# EasyEDA schematic barrel-encoder.json

## Sheets
1 Serial-To-Parallel Converter: TITLE: 8 Bit Serial to Parallel Converter; REV: 1.0; Date: 2020-07-02; Sheet: 1/1; Company: LEAP Org.
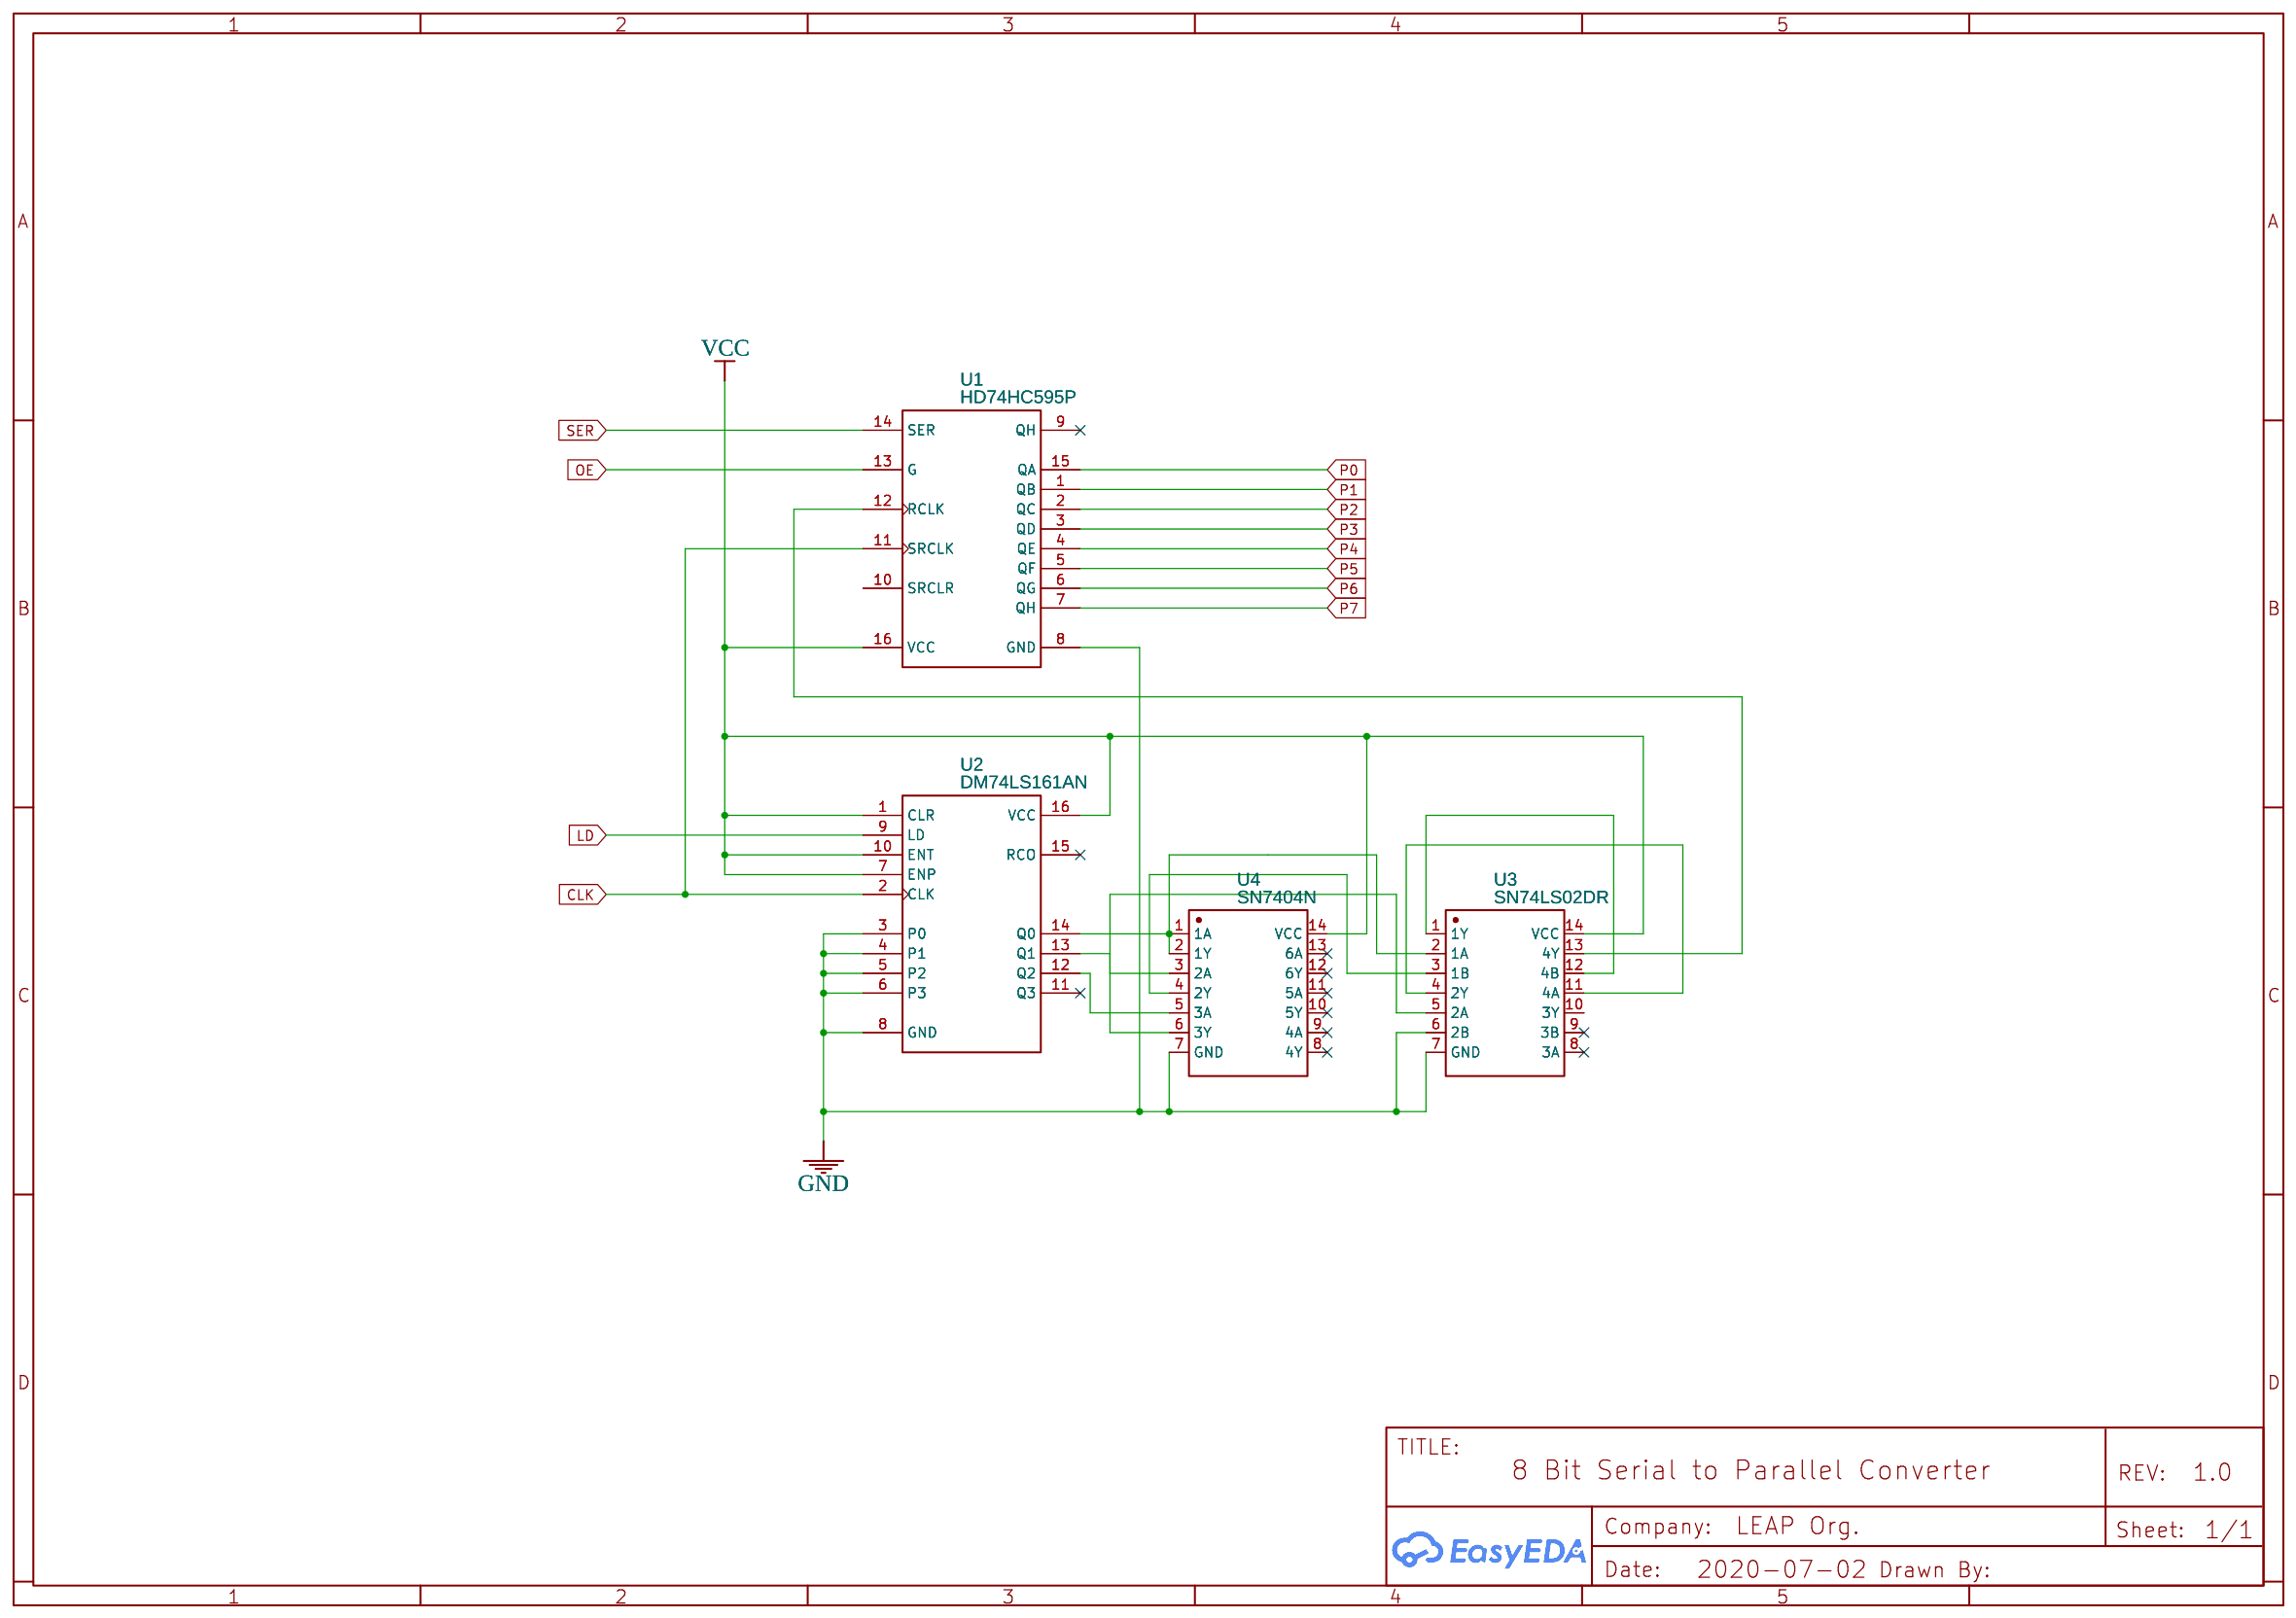
[diagram p0: Serial-To-Parallel Converter]
2 Pilot 8-bit Transmitter: TITLE: Pilot 8-bit Transmitter; Date: 2020-07-26; Drawn By: cSDes1gn; Company: LEAP Org
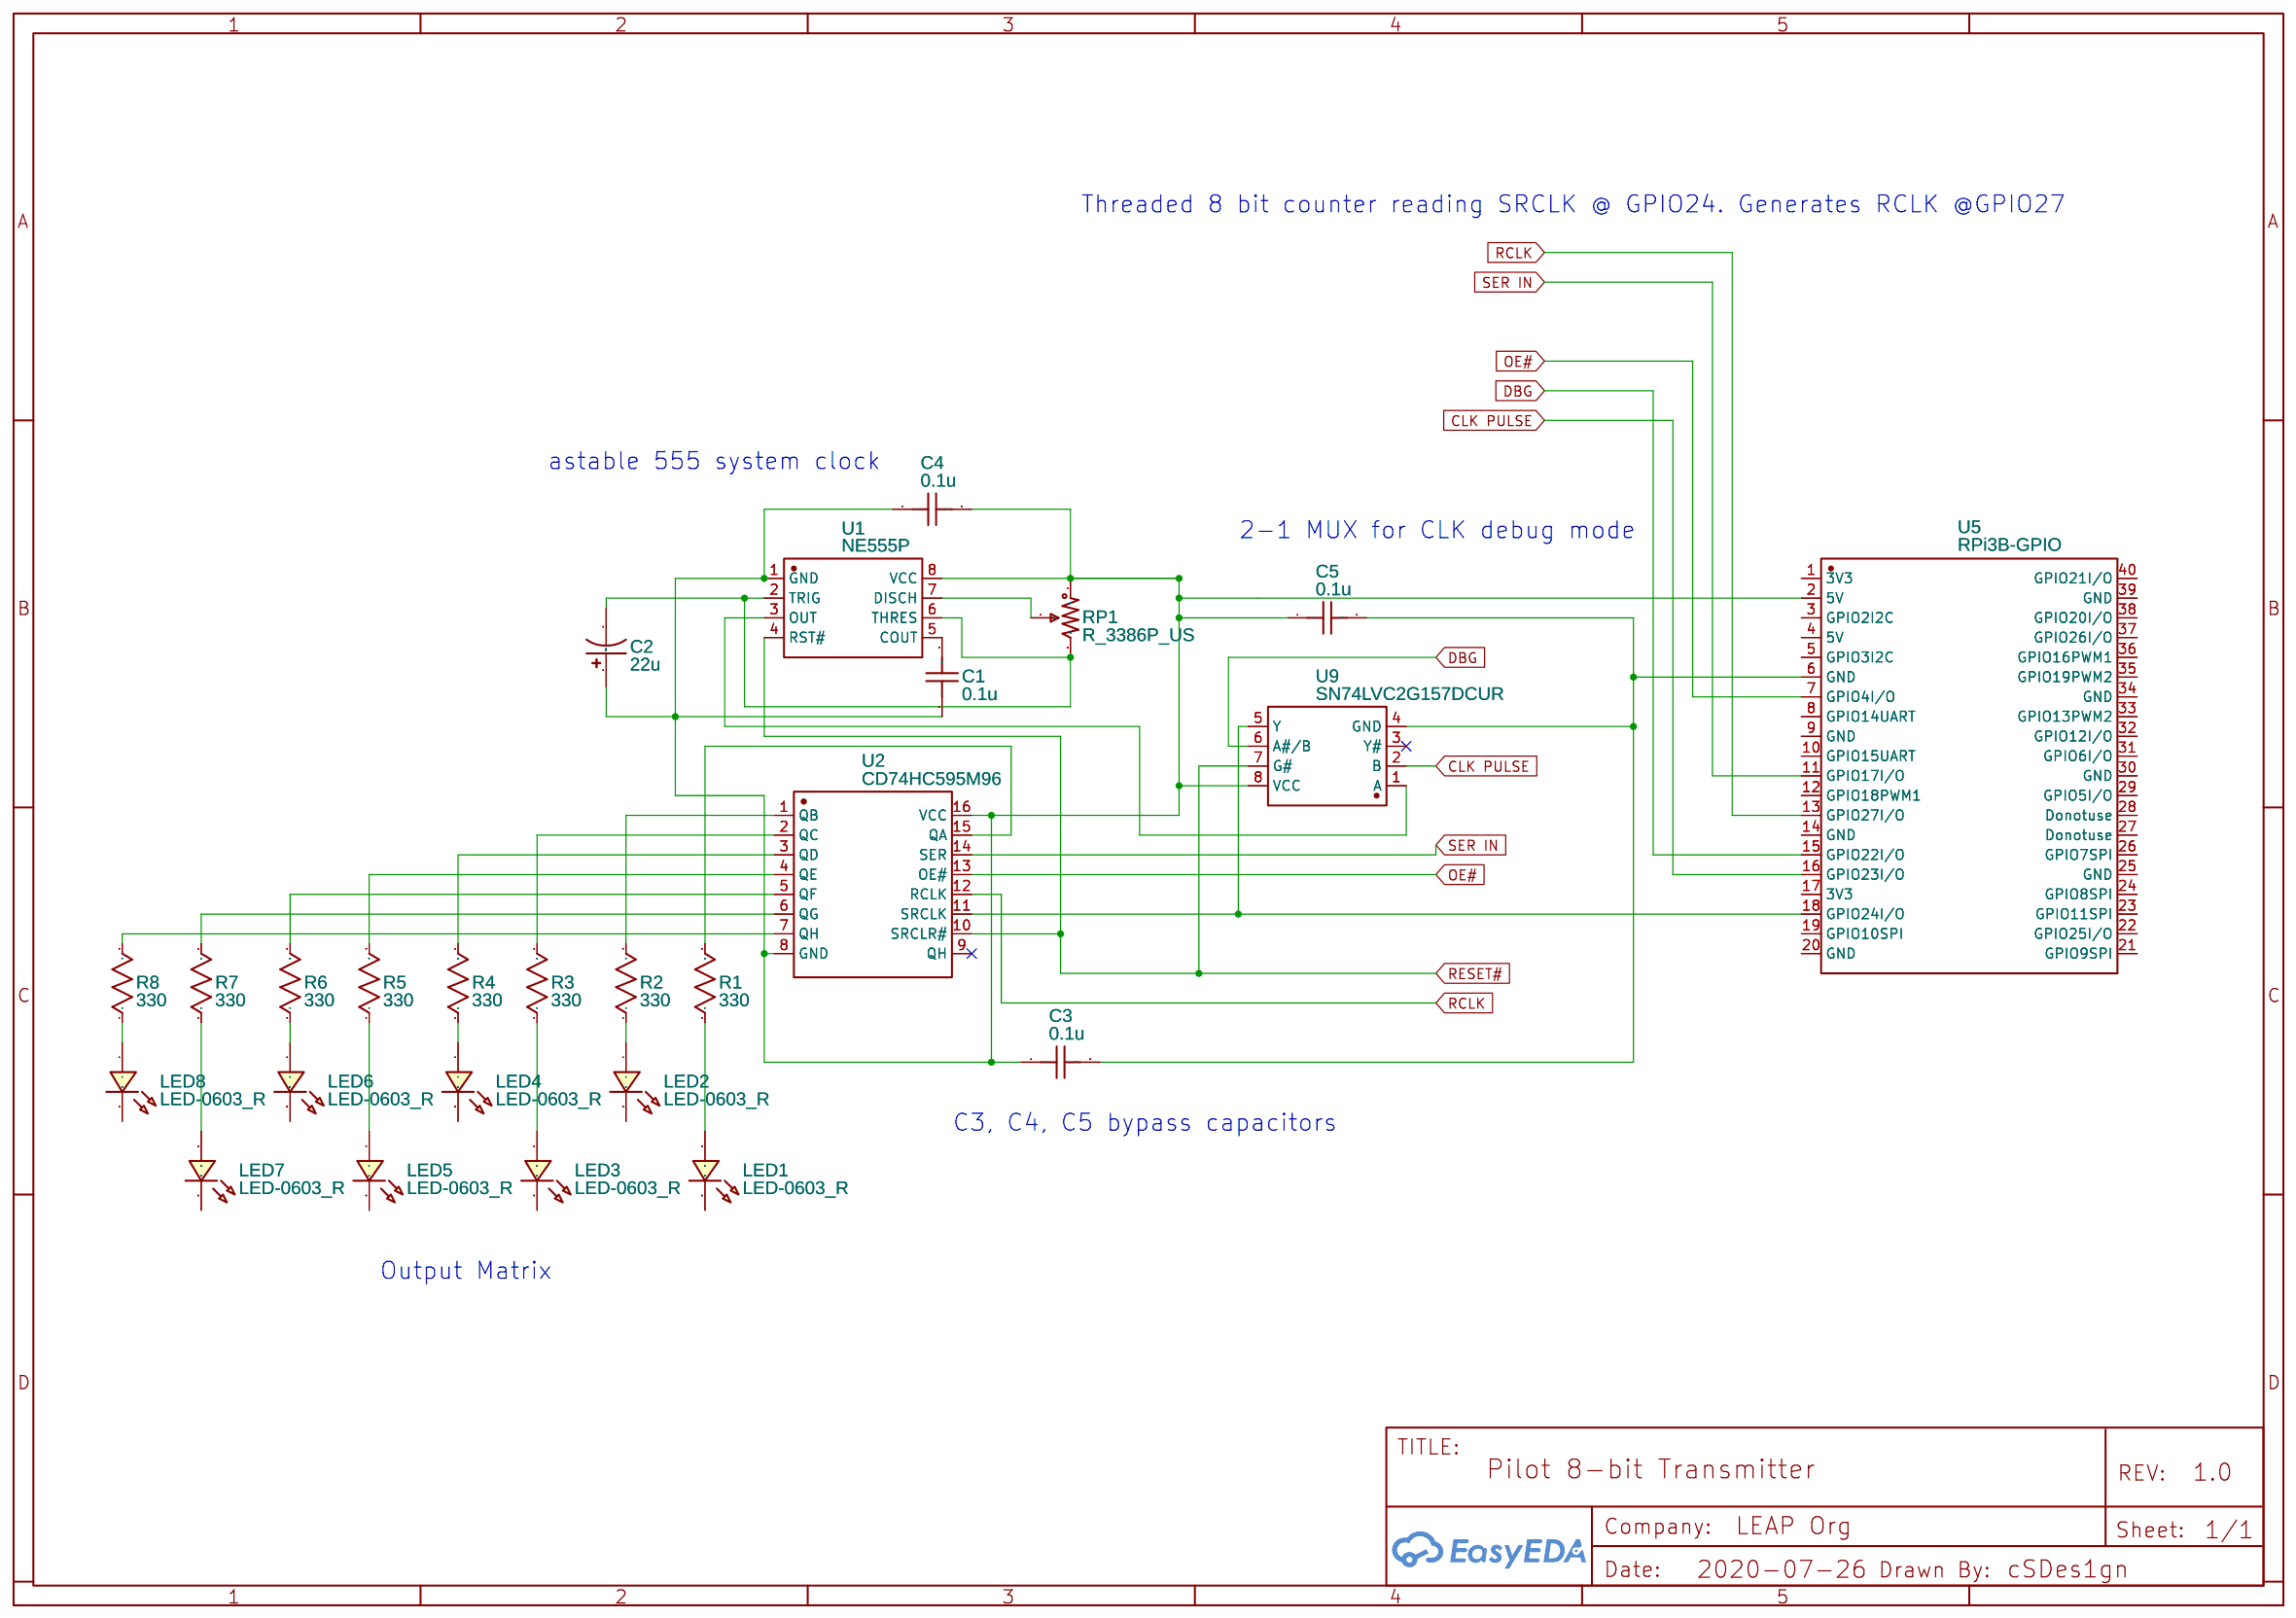
[diagram p1: Pilot 8-bit Transmitter]
3 Barrel Encoder: TITLE: Barrel Shifter; Date: 2020-10-22; Company: LEAP Systems
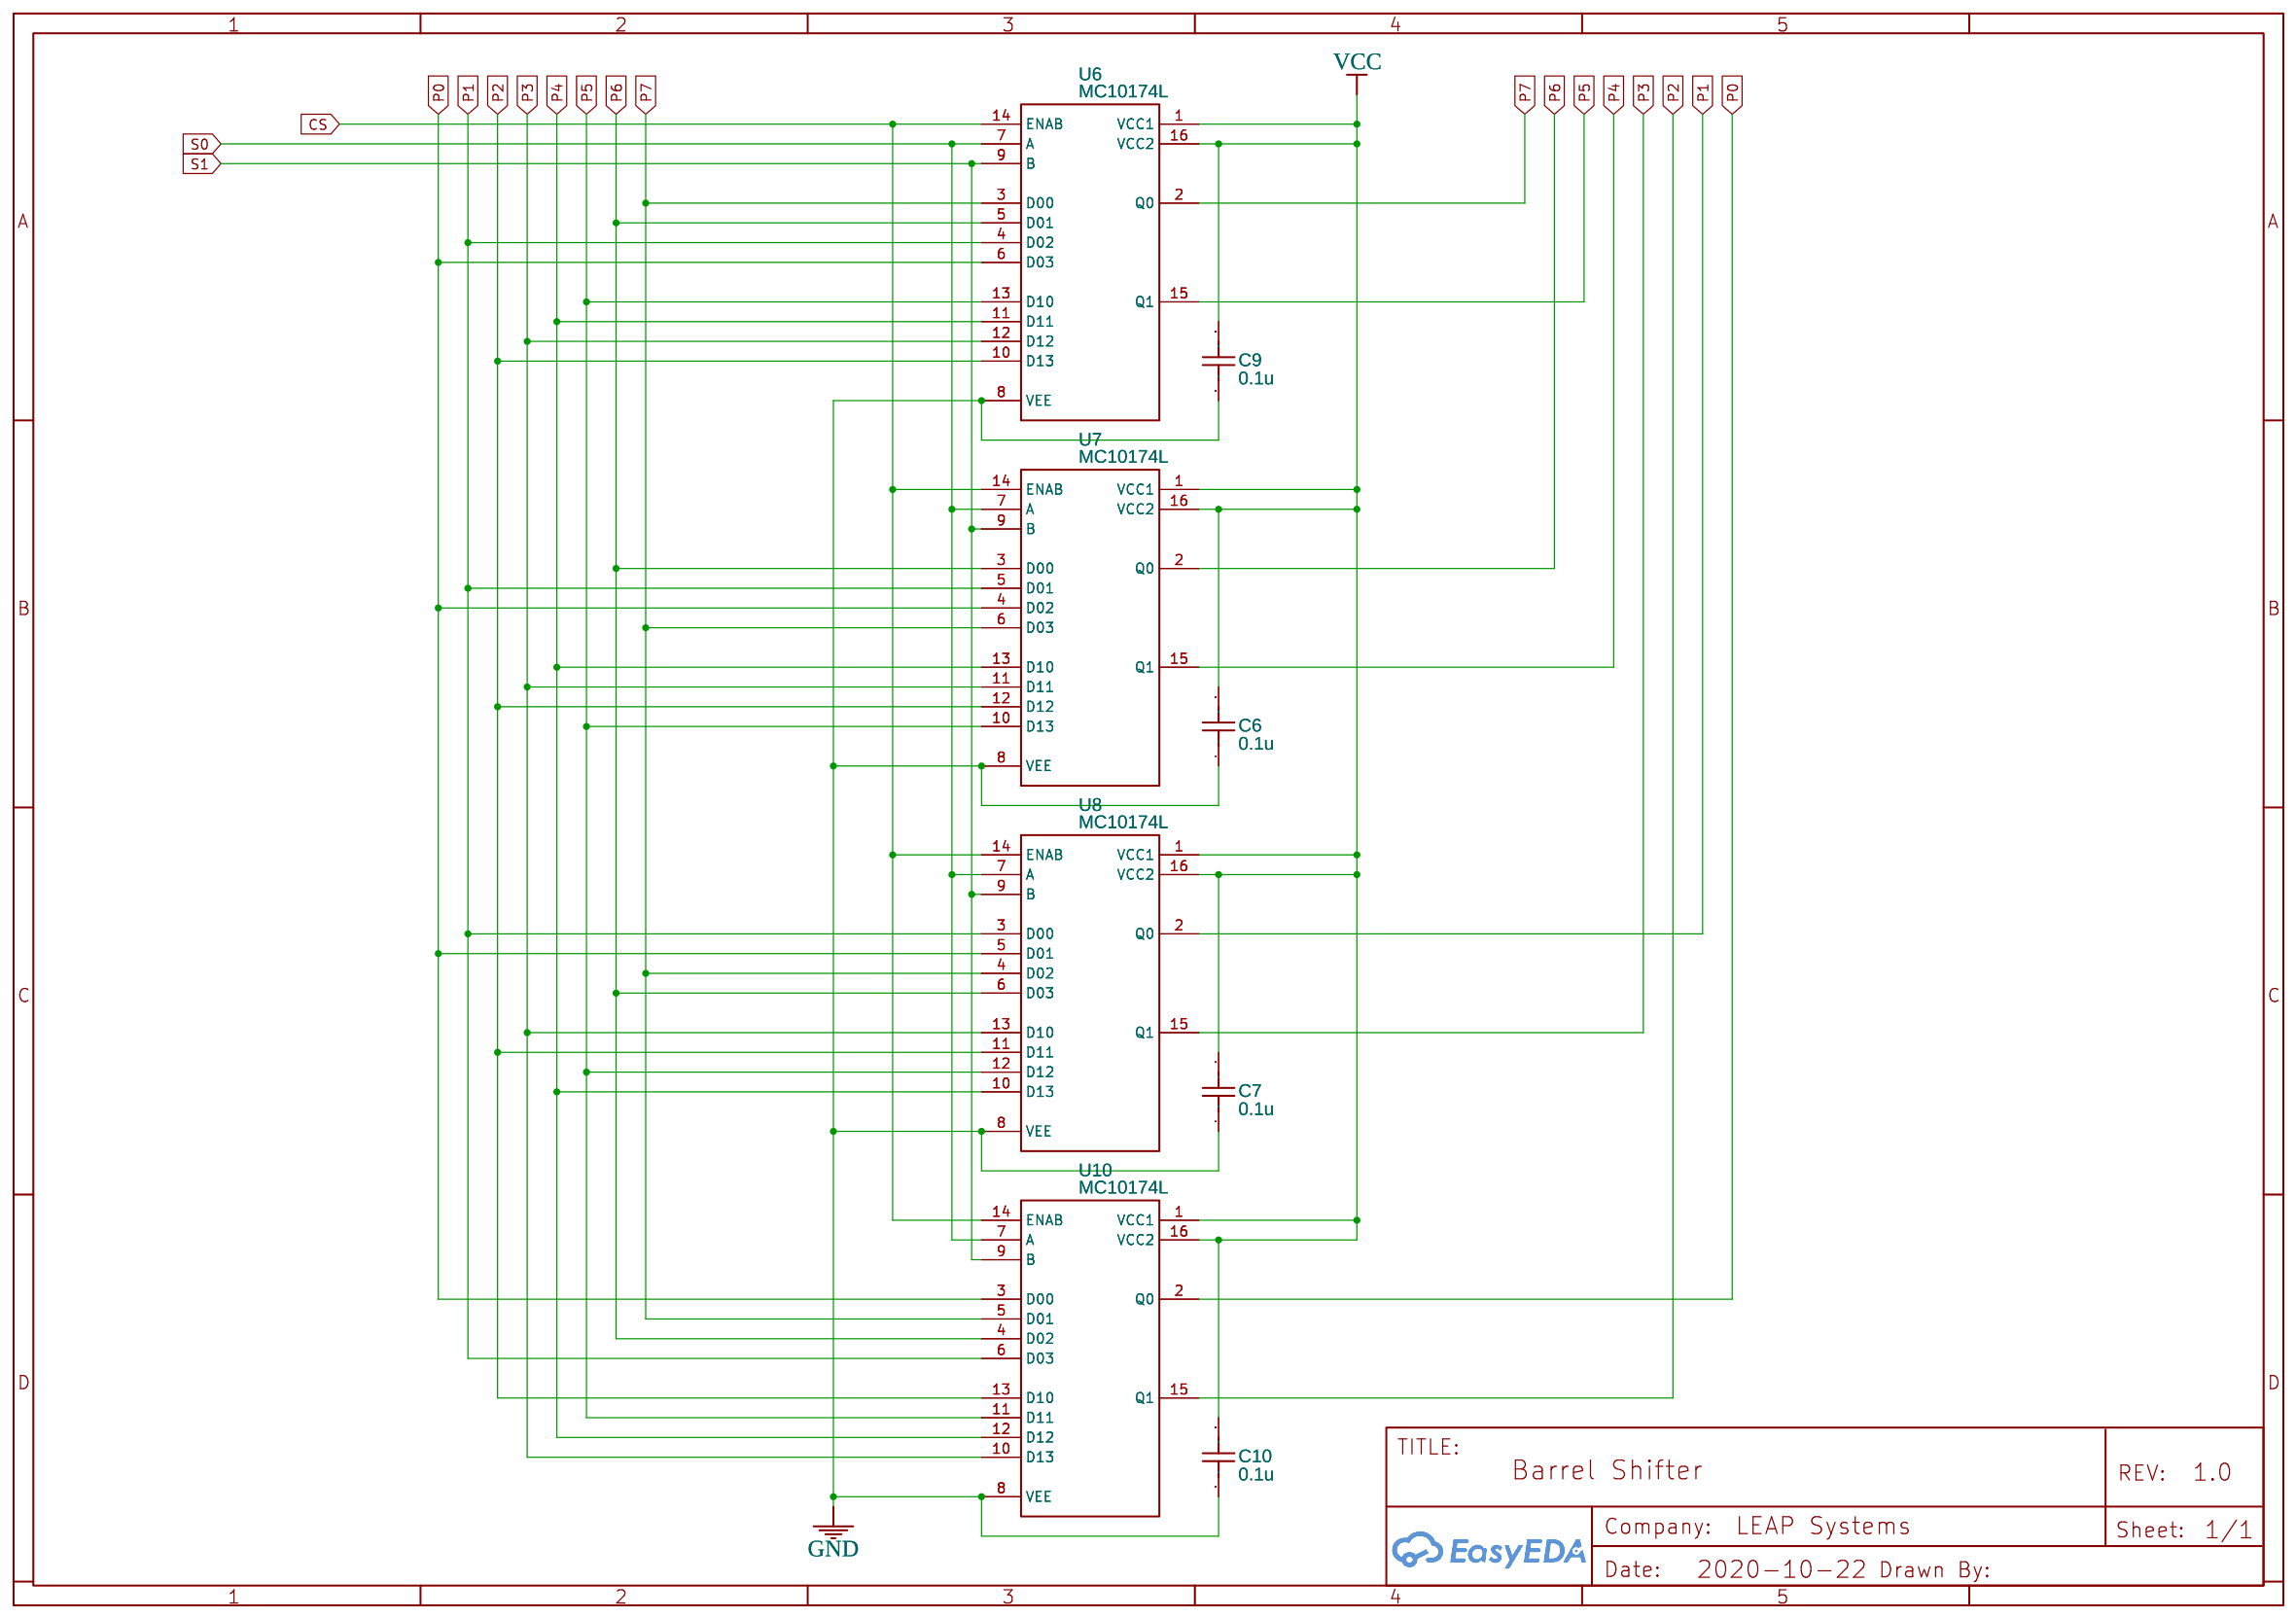
[diagram p2: Barrel Encoder]

## Parts
sheet Barrel Encoder
C6  0.1u  [C0603]
C7  0.1u  [C0603]
C9  0.1u  [C0603]
C10  0.1u  [C0603]
U6  MC10174L  [620-10]
U7  MC10174L  [620-10]
U8  MC10174L  [620-10]
U10  MC10174L  [620-10]
sheet Pilot 8-bit Transmitter
C1  0.1u  [C0201]
C2  22u  [CASE-A_3216]
C3  0.1u  [C0201]
C4  0.1u  [C0201]
C5  0.1u  [C0201]
LED1  LED-0603_R  [LED0603_RED]
LED2  LED-0603_R  [LED0603_RED]
LED3  LED-0603_R  [LED0603_RED]
LED4  LED-0603_R  [LED0603_RED]
LED5  LED-0603_R  [LED0603_RED]
LED6  LED-0603_R  [LED0603_RED]
LED7  LED-0603_R  [LED0603_RED]
LED8  LED-0603_R  [LED0603_RED]
R1  330  [R0201]
R2  330  [R0201]
R3  330  [R0201]
R4  330  [R0201]
R5  330  [R0201]
R6  330  [R0201]
R7  330  [R0201]
R8  330  [R0201]
RP1  R_3386P_US  [RES-ADJ-TH_3386P]
U1#2  NE555P  [DIP-8_L9.8-W6.6-P2.54-LS7.6-BL]
U2#2  CD74HC595M96  [SOIC-16_L10.8-W4.5-P1.27-LS6.8-BL]
U5  RPi3B-GPIO
U9  SN74LVC2G157DCUR  [VSSOP-8_L2.4-W2.1-P0.50-LS3.2-BL]
sheet Serial-To-Parallel Converter
U1  HD74HC595P  [DIP16]
U2  DM74LS161AN  [DIP16]
U3  SN74LS02DR  [SOIC-14_L8.7-W3.9-P1.27-LS6.0-BL]
U4  SN7404N  [DIP14]

## Library data of the parts
C6 C7 C9 C10 = C_0603_US: Contributor: LCEDA_Lib
U6-U8 U10 = MC10174L: Dual 4:1 Multiplexer
C1 C3-C5 = C_0201_US: Contributor: LCEDA_Lib
C2 = C_Tan_SMD_A_US: Contributor: LCEDA_Lib
LED1-LED8 = LED-0603_R: Manufacturer: EVERLIGHT(台湾亿光); Manufacturer Part: 19-217/R6C-AL1M2VY/3T; Supplier Part: C72044; Supplier: LCSC; Contributor: LCEDA_01
R1-R8 = R_0201_US: Contributor: LCEDA_Lib
RP1 = R_3386P_US: Supplier: LCSC; Contributor: LCEDA_Lib; value(Ω): 10K
U1#2 = NE555P: Supplier: LCSC; Manufacturer: TI; image: //image.lceda.cn/szlcsc/C46749.jpg; Supplier Part: C46749
U2#2 = CD74HC595M96: Supplier: LCSC; Manufacturer: TI; Supplier Part: C131977; LCSC Assembly: Yes; SMT Type: Extend
U5 = RPi3B-GPIO: Contributor: gamehero00s
U9 = SN74LVC2G157DCUR: Supplier: LCSC; Supplier Part: C473347; Manufacturer: Texas Instruments; Contributor: LCSC
U1 = HD74HC595P: 8-bit Shift Register  Latch with 3-State Outputs
U2 = DM74LS161AN: Synchronous 4-Bit Binary Counter
U3 = SN74LS02DR: Supplier: LCSC; Manufacturer: TI; image: //image.lceda.cn/szlcsc/C6794.jpg; Supplier Part: C6794; LCSC Assembly: Yes; SMT Type: Extend
U4 = SN7404N

## Nets
GND: C6.1 C7.1 C9.1 C10.1 U1.8(GND) U2.3(P0) U2.4(P1) U2.5(P2) U2.6(P3) U2.8(GND) U3.6(2B) U3.7(GND) U4.7(GND) U6.8(VEE) U7.8(VEE) U8.8(VEE) U10.8(VEE)
VCC: C6.2 C7.2 C9.2 C10.2 U1.16(VCC) U2.1(CLR) U2.7(ENP) U2.10(ENT) U2.16(VCC) U3.14(VCC) U4.14(VCC) U6.1(VCC1) U6.16(VCC2) U7.1(VCC1) U7.16(VCC2) U8.1(VCC1) U8.16(VCC2) U10.1(VCC1) U10.16(VCC2)
CLK: U1.11(SRCLK) U2.2(CLK)
CLK PULSE: U5.16(GPIO23I/O) U9.2(B)
CS: U6.14(ENAB) U7.14(ENAB) U8.14(ENAB) U10.14(ENAB)
DBG: U5.15(GPIO22I/O) U9.6(A#/B)
LD: U2.9(LD)
OE: U1.13(G)
OE#: U2#2.13(OE#) U5.7(GPIO4I/O)
P0: U1.15(QA) U6.6(D03) U7.4(D02) U8.5(D01) U10.2(Q0) U10.3(D00)
P1: U1.1(QB) U6.4(D02) U7.5(D01) U8.2(Q0) U8.3(D00) U10.6(D03)
P2: U1.2(QC) U6.10(D13) U7.12(D12) U8.11(D11) U10.13(D10) U10.15(Q1)
P3: U1.3(QD) U6.12(D12) U7.11(D11) U8.13(D10) U8.15(Q1) U10.10(D13)
P4: U1.4(QE) U6.11(D11) U7.13(D10) U7.15(Q1) U8.10(D13) U10.12(D12)
P5: U1.5(QF) U6.13(D10) U6.15(Q1) U7.10(D13) U8.12(D12) U10.11(D11)
P6: U1.6(QG) U6.5(D01) U7.2(Q0) U7.3(D00) U8.6(D03) U10.4(D02)
P7: U1.7(QH) U6.2(Q0) U6.3(D00) U7.6(D03) U8.4(D02) U10.5(D01)
RCLK: U2#2.12(RCLK) U5.13(GPIO27I/O)
RESET#: U1#2.4(RST#) U2#2.10(SRCLR#) U9.7(G#)
S0: U6.7(A) U7.7(A) U8.7(A) U10.7(A)
S1: U6.9(B) U7.9(B) U8.9(B) U10.9(B)
SER: U1.14(SER)
SER IN: U2#2.14(SER) U5.11(GPIO17I/O)
Net-(C1-1): C1.1 C2.1 C3.1 C4.1 C4.2 C5.1 RP1.1 U1#2.1(GND) U1#2.8(VCC) U2#2.8(GND) U2#2.16(VCC) U5.2(5V) U9.8(VCC)
Net-(C1-2): C1.2 U1#2.5(COUT)
Net-(C2-2): C2.2 RP1.3 U1#2.2(TRIG) U1#2.6(THRES)
Net-(C3-2): C3.2 C5.2 U5.6(GND) U9.4(GND)
Net-(LED1-1): LED1.1 R1.1
Net-(LED2-1): LED2.1 R2.1
Net-(LED3-1): LED3.1 R3.1
Net-(LED4-1): LED4.1 R4.1
Net-(LED5-1): LED5.1 R5.1
Net-(LED6-1): LED6.1 R6.1
Net-(LED7-1): LED7.1 R7.1
Net-(LED8-1): LED8.1 R8.1
Net-(R1-2): R1.2 U2#2.15(QA)
Net-(R2-2): R2.2 U2#2.1(QB)
Net-(R3-2): R3.2 U2#2.2(QC)
Net-(R4-2): R4.2 U2#2.3(QD)
Net-(R5-2): R5.2 U2#2.4(QE)
Net-(R6-2): R6.2 U2#2.5(QF)
Net-(R7-2): R7.2 U2#2.6(QG)
Net-(R8-2): R8.2 U2#2.7(QH)
Net-(RP1-2): RP1.2 U1#2.7(DISCH)
Net-(U1#2-3): U1#2.3(OUT) U9.1(A)
Net-(U1-12): U1.12(RCLK) U3.13(4Y)
Net-(U2#2-11): U2#2.11(SRCLK) U5.18(GPIO24I/O) U9.5(Y)
Net-(U2-12): U2.12(Q2) U4.5(3A)
Net-(U2-13): U2.13(Q1) U4.3(2A)
Net-(U2-14): U2.14(Q0) U3.2(1A) U4.1(1A) U4.2(1Y)
Net-(U3-1): U3.1(1Y) U3.12(4B)
Net-(U3-3): U3.3(1B) U4.4(2Y)
Net-(U3-4): U3.4(2Y) U3.11(4A)
Net-(U3-5): U3.5(2A) U4.6(3Y)

Not connected (* = marked no-connect by the designer): LED1 2; LED2 2; LED3 2; LED4 2; LED5 2; LED6 2; LED7 2; LED8 2; U1 9(QH)* 10(SRCLR); U2 11(Q3)* 15(RCO)*; U2#2 9(QH)*; U3 8(3A)* 9(3B)* 10(3Y); U4 8(4Y)* 9(4A)* 10(5Y)* 11(5A)* 12(6Y)* 13(6A)*; U5 1(3V3) 3(GPIO2I2C) 4(5V) 5(GPIO3I2C) 8(GPIO14UART) 9(GND) 10(GPIO15UART) 12(GPIO18PWM1) 14(GND) 17(3V3) 19(GPIO10SPI) 20(GND) 21(GPIO9SPI) 22(GPIO25I/O) 23(GPIO11SPI) 24(GPIO8SPI) 25(GND) 26(GPIO7SPI) 27(Donotuse) 28(Donotuse) 29(GPIO5I/O) 30(GND) 31(GPIO6I/O) 32(GPIO12I/O) 33(GPIO13PWM2) 34(GND) 35(GPIO19PWM2) 36(GPIO16PWM1) 37(GPIO26I/O) 38(GPIO20I/O) 39(GND) 40(GPIO21I/O); U9 3(Y#)*

## Notes on the sheets
sheet 2
- Threaded 8 bit counter reading SRCLK @ GPIO24. Generates RCLK @GPIO27
- astable 555 system clock
- 2-1 MUX for CLK debug mode
- C3, C4, C5 bypass capacitors
- Output Matrix
